# Altium schematic sheet board_32.SchDoc
size A4
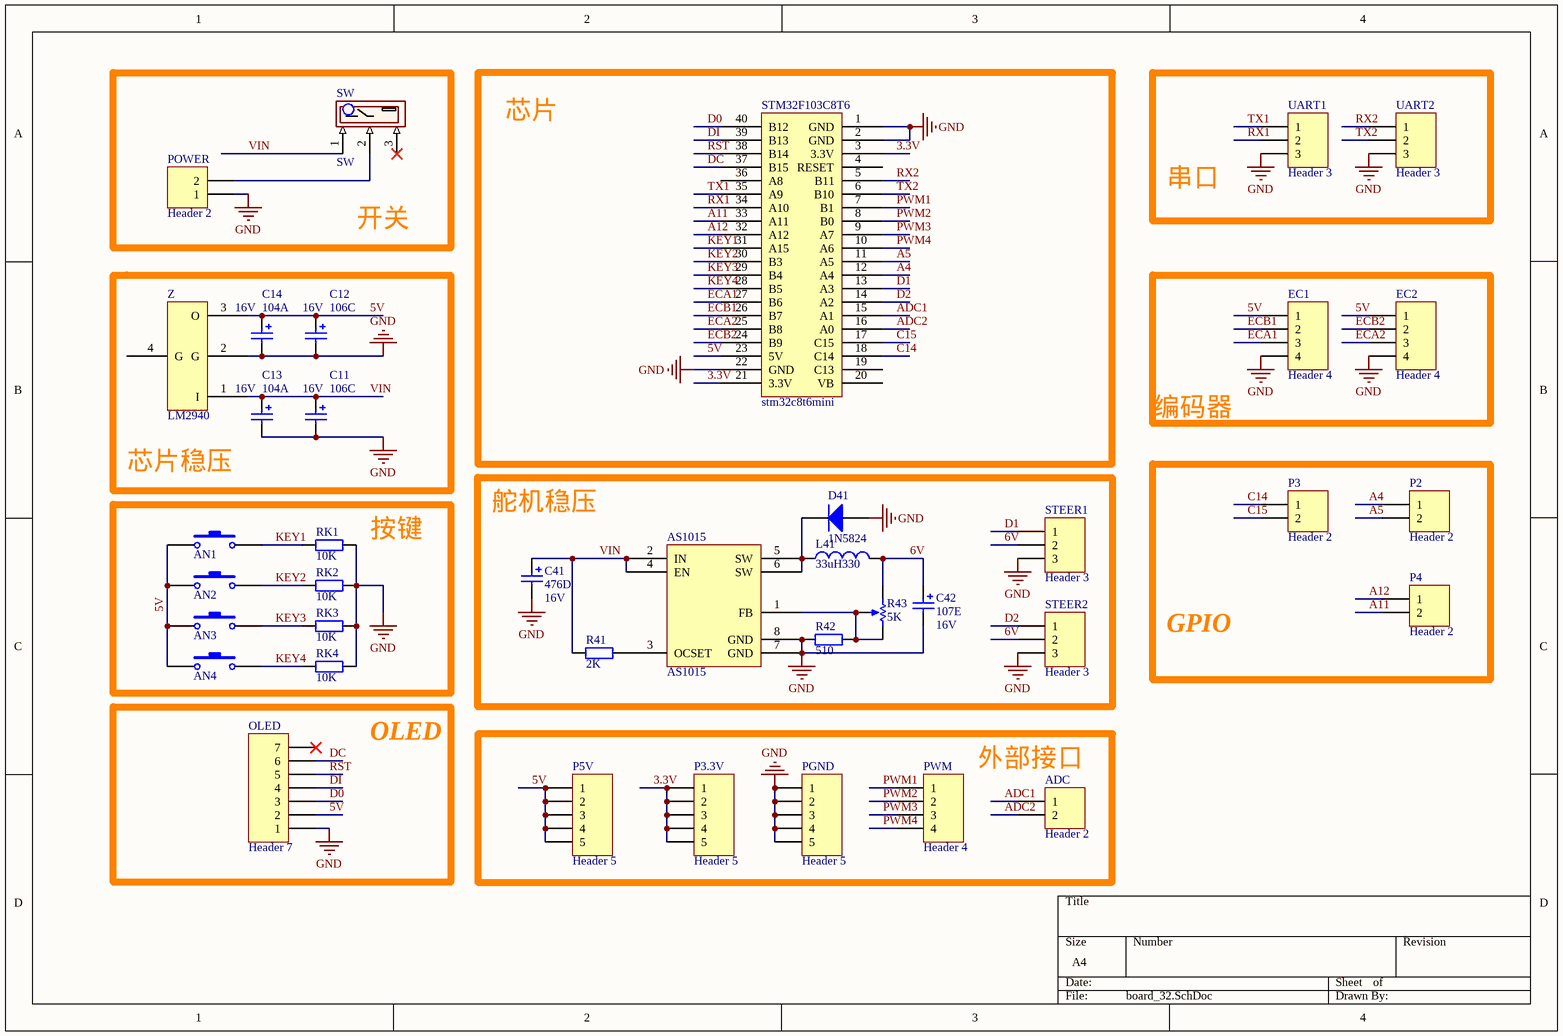
[diagram p0: board_32.SchDoc]

## Parts
ADC  Header 2  [HDR1X2]
AN1  Button  [SMT4*6.2*4]  (value not drawn)
AN2  Button  [SMT4*6.2*4]  (value not drawn)
AN3  Button  [SMT4*6.2*4]  (value not drawn)
AN4  Button  [SMT4*6.2*4]  (value not drawn)
AS1015  AS1015  [SOP-8N]
C11  Capacitance: 106C  Voltage: 16V  [TAN-C-6032]  (hidden comment: Cap Tan C)
C12  Capacitance: 106C  Voltage: 16V  [TAN-C-6032]  (hidden comment: Cap Tan C)
C13  value 104A  Voltage: 16V  [TAN-A-3216]  (hidden comment: Cap Tan A)
C14  value 104A  Voltage: 16V  [TAN-A-3216]  (hidden comment: Cap Tan A)
C41  Capacitance: 476D  Voltage: 16V  [C7361]  (hidden comment: Cap Tan E)
C42  Capacitance: 107E  Voltage: 16V  [TAN-E-7361]  (hidden comment: Cap Tan E)
D41  1N5824  [SMB]
EC1  Header 4  [HDR1X4]
EC2  Header 4  [HDR1X4]
L41  value 33uH330  [CD75NP]  (hidden comment: Inductor)
OLED  Header 7  [HDR1X7]
P2  Header 2  [HDR1X2]
P3  Header 2  [HDR1X2]
P3.3V  Header 5  [HDR1X5]
P4  Header 2  [HDR1X2]
P5V  Header 5  [HDR1X5]
PGND  Header 5  [HDR1X5]
POWER  Header 2  [2PIN-5.08A]
PWM  Header 4  [HDR1X4]
R41  value 2K  [R0805]  (hidden comment: Resistor Chip 0805)
R42  value 510  [R0805]  (hidden comment: Resistor Chip 0805)
R43  value 5K  [VR_B1]  (hidden comment: RPot)
RK1  value 10K  [R0805]  (hidden comment: Resistor Chip 0805)
RK2  value 10K  [R0805]  (hidden comment: Resistor Chip 0805)
RK3  value 10K  [R0805]  (hidden comment: Resistor Chip 0805)
RK4  value 10K  [R0805]  (hidden comment: Resistor Chip 0805)
STEER1  Header 3  [HDR1X3]
STEER2  Header 3  [HDR1X3]
STM32F103C8T6  stm32c8t6mini  [DIP-40]
SW  SW  [SW-TO3]
UART1  Header 3  [HDR1X3]
UART2  Header 3  [HDR1X3]
Z  LM2940  [TO-220E]

## Blocks framed on the sheet
开关: POWER SW
芯片: STM32F103C8T6
串口: UART1 UART2
芯片稳压: C11-C14 Z
编码器: EC1 EC2
按键: AN1-AN4 RK1-RK4
舵机稳压: AS1015 C41 C42 D41 L41 R41-R43 STEER1 STEER2
GPIO: P2-P4
OLED: OLED
外部接口: ADC P3.3V P5V PGND PWM

## Nets
GND: AS1015.7(GND) AS1015.8(GND) C11.1 C12.1 C13.1 C14.1 C41.1 C42.1 D41.1(A) EC1.4 EC2.4 OLED.1 PGND.1 PGND.2 PGND.3 PGND.4 PGND.5 POWER.1 R42.1 RK1.2 RK2.2 RK3.2 RK4.2 STEER1.3 STEER2.3 STM32F103C8T6.1(GND) STM32F103C8T6.2(GND) STM32F103C8T6.22(GND) UART1.3 UART2.3 Z.2(G)
3.3V: P3.3V.1 P3.3V.2 P3.3V.3 P3.3V.4 P3.3V.5 STM32F103C8T6.3(3.3V) STM32F103C8T6.21(3.3V)
5V: AN1.2 AN2.2 AN3.2 AN4.2 C12.2 C14.2 EC1.1 EC2.1 OLED.2 P5V.1 P5V.2 P5V.3 P5V.4 P5V.5 STM32F103C8T6.23(5V) Z.3(O)
6V: C42.2 L41.2 R43.1(TOP) STEER1.2 STEER2.2
A4: P2.1 STM32F103C8T6.12(A4)
A5: P2.2 STM32F103C8T6.11(A5)
A11: P4.2 STM32F103C8T6.33(A11)
A12: P4.1 STM32F103C8T6.32(A12)
ADC1: ADC.1 STM32F103C8T6.15(A1)
ADC2: ADC.2 STM32F103C8T6.16(A0)
C14: P3.1 STM32F103C8T6.18(C14)
C15: P3.2 STM32F103C8T6.17(C15)
D0: OLED.3 STM32F103C8T6.40(B12)
D1: STEER1.1 STM32F103C8T6.13(A3)
D2: STEER2.1 STM32F103C8T6.14(A2)
DC: OLED.6 STM32F103C8T6.37(B15)
DI: OLED.4 STM32F103C8T6.39(B13)
ECA1: EC1.3 STM32F103C8T6.27(B6)
ECA2: EC2.3 STM32F103C8T6.25(B8)
ECB1: EC1.2 STM32F103C8T6.26(B7)
ECB2: EC2.2 STM32F103C8T6.24(B9)
KEY1: AN1.1 RK1.1 STM32F103C8T6.31(A15)
KEY2: AN2.1 RK2.1 STM32F103C8T6.30(B3)
KEY3: AN3.1 RK3.1 STM32F103C8T6.29(B4)
KEY4: AN4.1 RK4.1 STM32F103C8T6.28(B5)
PWM1: PWM.1 STM32F103C8T6.7(B1)
PWM2: PWM.2 STM32F103C8T6.8(B0)
PWM3: PWM.3 STM32F103C8T6.9(A7)
PWM4: PWM.4 STM32F103C8T6.10(A6)
RST: OLED.5 STM32F103C8T6.38(B14)
RX1: STM32F103C8T6.34(A10) UART1.2
RX2: STM32F103C8T6.5(B11) UART2.1
TX1: STM32F103C8T6.35(A9) UART1.1
TX2: STM32F103C8T6.6(B10) UART2.2
VIN: AS1015.2(IN) AS1015.4(EN) C11.2 C13.2 C41.2 R41.1 SW.1 Z.1(I)
NetAS1015_1: AS1015.1(FB) R42.2 R43.2(TAP) R43.3(BOT)
NetAS1015_3: AS1015.3(OCSET) R41.2
NetAS1015_5: AS1015.5(SW) AS1015.6(SW) D41.2(K) L41.1
NetPOWER_2: POWER.2 SW.2

Not connected (* = marked no-connect by the designer): OLED 7*; STM32F103C8T6 4(RESET) 19(C13) 20(VB) 36(A8); SW 3*; Z 4(G)

## Library data of the parts
ADC P2-P4 POWER = Header 2: Header, 2-Pin; LatestRevisionDate: 17-Jul-2002; LatestRevisionNote: Re-released for DXP Platform.; Publisher: Altium Limited
C11 C12 = Cap Tan C: Polarized Capacitor (Radial); Published: 8-Jun-2000; Revision: July-2002: Re-released for DXP Platform.; Publisher: Altium Limited
C13 C14 = Cap Tan A: Polarized Capacitor (Radial); Published: 8-Jun-2000; Revision: July-2002: Re-released for DXP Platform.; Publisher: Altium Limited
C41 C42 = Cap Tan E: Polarized Capacitor (Radial); Published: 8-Jun-2000; Revision: July-2002: Re-released for DXP Platform.; Publisher: Altium Limited
D41 = 1N4007: 1.0 Ampere General Purpose Rectifier; Published: 8-Jun-2000; LatestRevisionDate: 17-Jul-2002; LatestRevisionNote: Re-released for DXP Platform.; DatasheetDocument: 1998; PackageDocument: Aug-1999; PackageReference: DO-41; Publisher: Altium Limited; Code_JEDEC: DO-204-AL; ComponentLink1Description: Manufacturer Link; ComponentLink1URL: http://www.fairchildsemi.com/; ComponentLink2Description: Pinout Specification; ComponentLink2URL: http://www.fairchildsemi.com/ds/1N%2F1N4001.pdf
EC1 EC2 PWM = Header 4: Header, 4-Pin; LatestRevisionDate: 17-Jul-2002; LatestRevisionNote: Re-released for DXP Platform.; Publisher: Altium Limited
L41 = Inductor: Code_IEC: 1005; Published: 8-Jun-2000; LatestRevisionDate: 29-May-2009; LatestRevisionNote: IPC-7351 Footprint Added.; PackageReference: 0402-A; Publisher: Altium Limited; PackageDescription: Chip Inductor; Code_JEITA: 0402
OLED = Header 7: Header, 7-Pin; LatestRevisionDate: 17-Jul-2002; LatestRevisionNote: Re-released for DXP Platform.; Publisher: Altium Limited
P3.3V P5V PGND = Header 5: Header, 5-Pin; LatestRevisionDate: 17-Jul-2002; LatestRevisionNote: Re-released for DXP Platform.; Publisher: Altium Limited
R41 R42 RK1-RK4 = Resistor Chip 0805: Resistor; Published: 8-Jun-2000; Revision: July-2002: Re-released for DXP Platform.; Publisher: Altium Limited
R43 = RPot: 精密可调电阻; Sim Note: Enter the Resistance value and the set point into parameter fields.; Set Position: 0.5; Published: 8-Jun-2000; LatestRevisionDate: 17-Jul-2002; LatestRevisionNote: Re-released for DXP Platform.; PackageReference: VR5; Publisher: Altium Limited
STEER1 STEER2 UART1 UART2 = Header 3: Header, 3-Pin; LatestRevisionDate: 17-Jul-2002; LatestRevisionNote: Re-released for DXP Platform.; Publisher: Altium Limited
SW = 开关三脚大电流
Z = LM2940: SOT-223
AN1-AN4 = Button: Published: 24-Mar-1999; LatestRevisionDate: 17-Jul-2002; LatestRevisionNote: Re-released for DXP Platform.; PackageReference: SPST-2; Publisher: Altium Limited